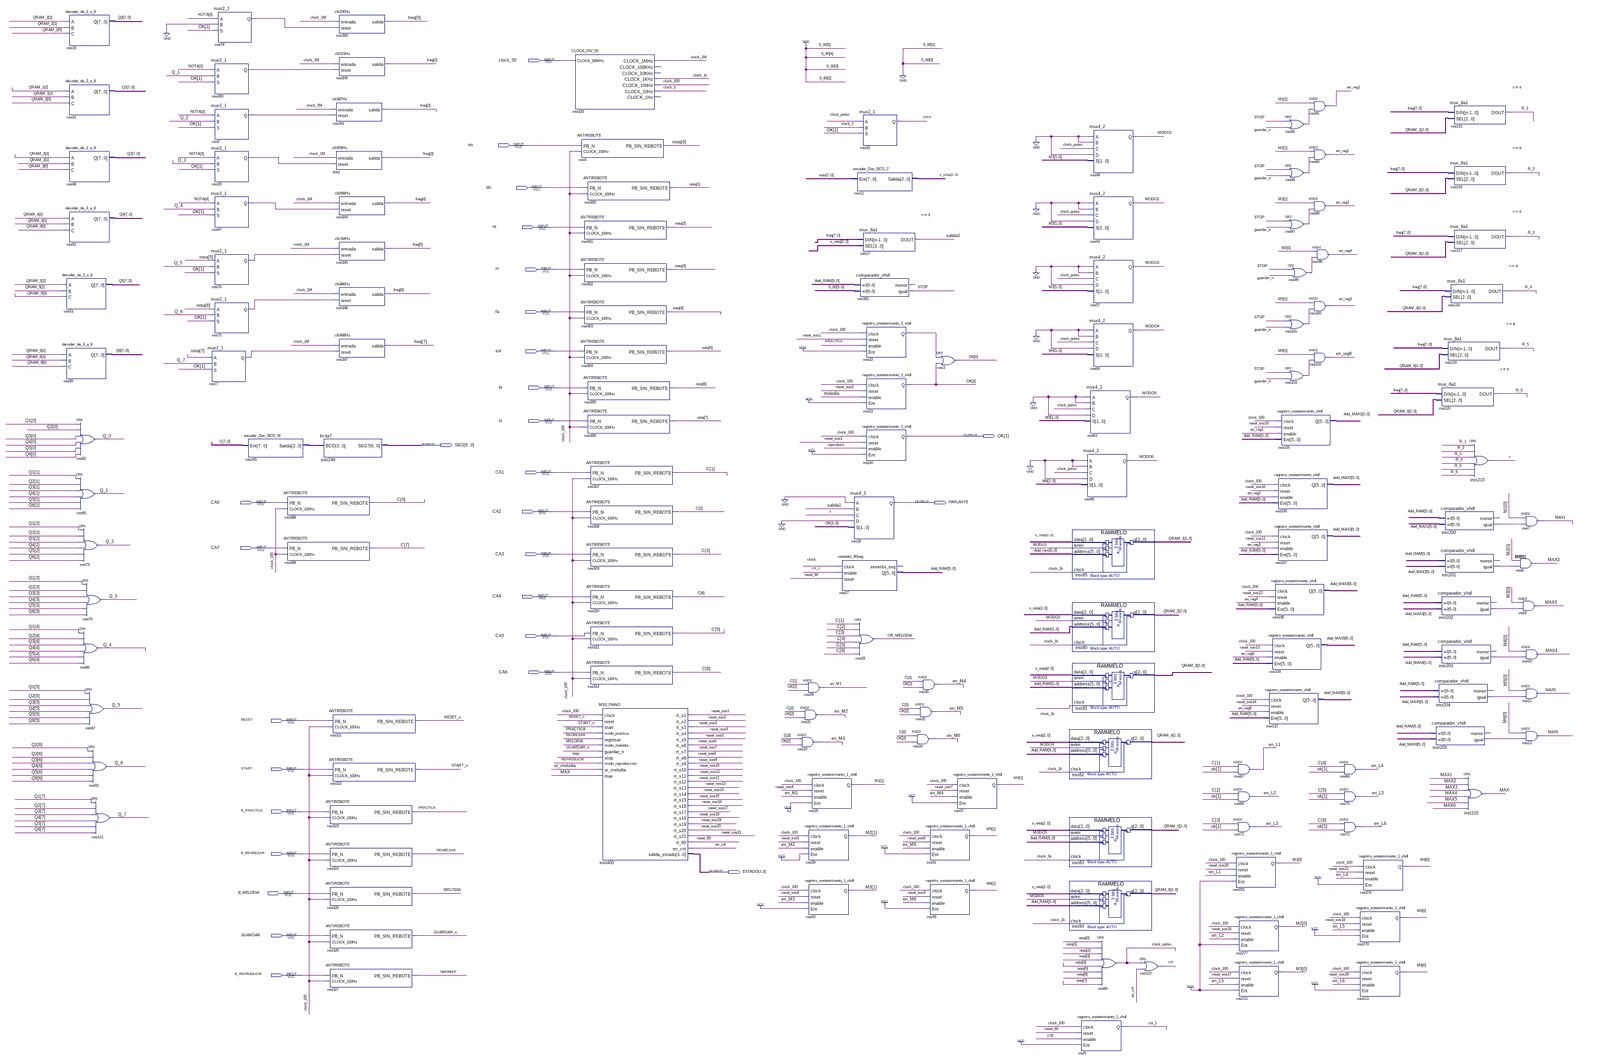
[diagram p0: schematic sheet, whole]
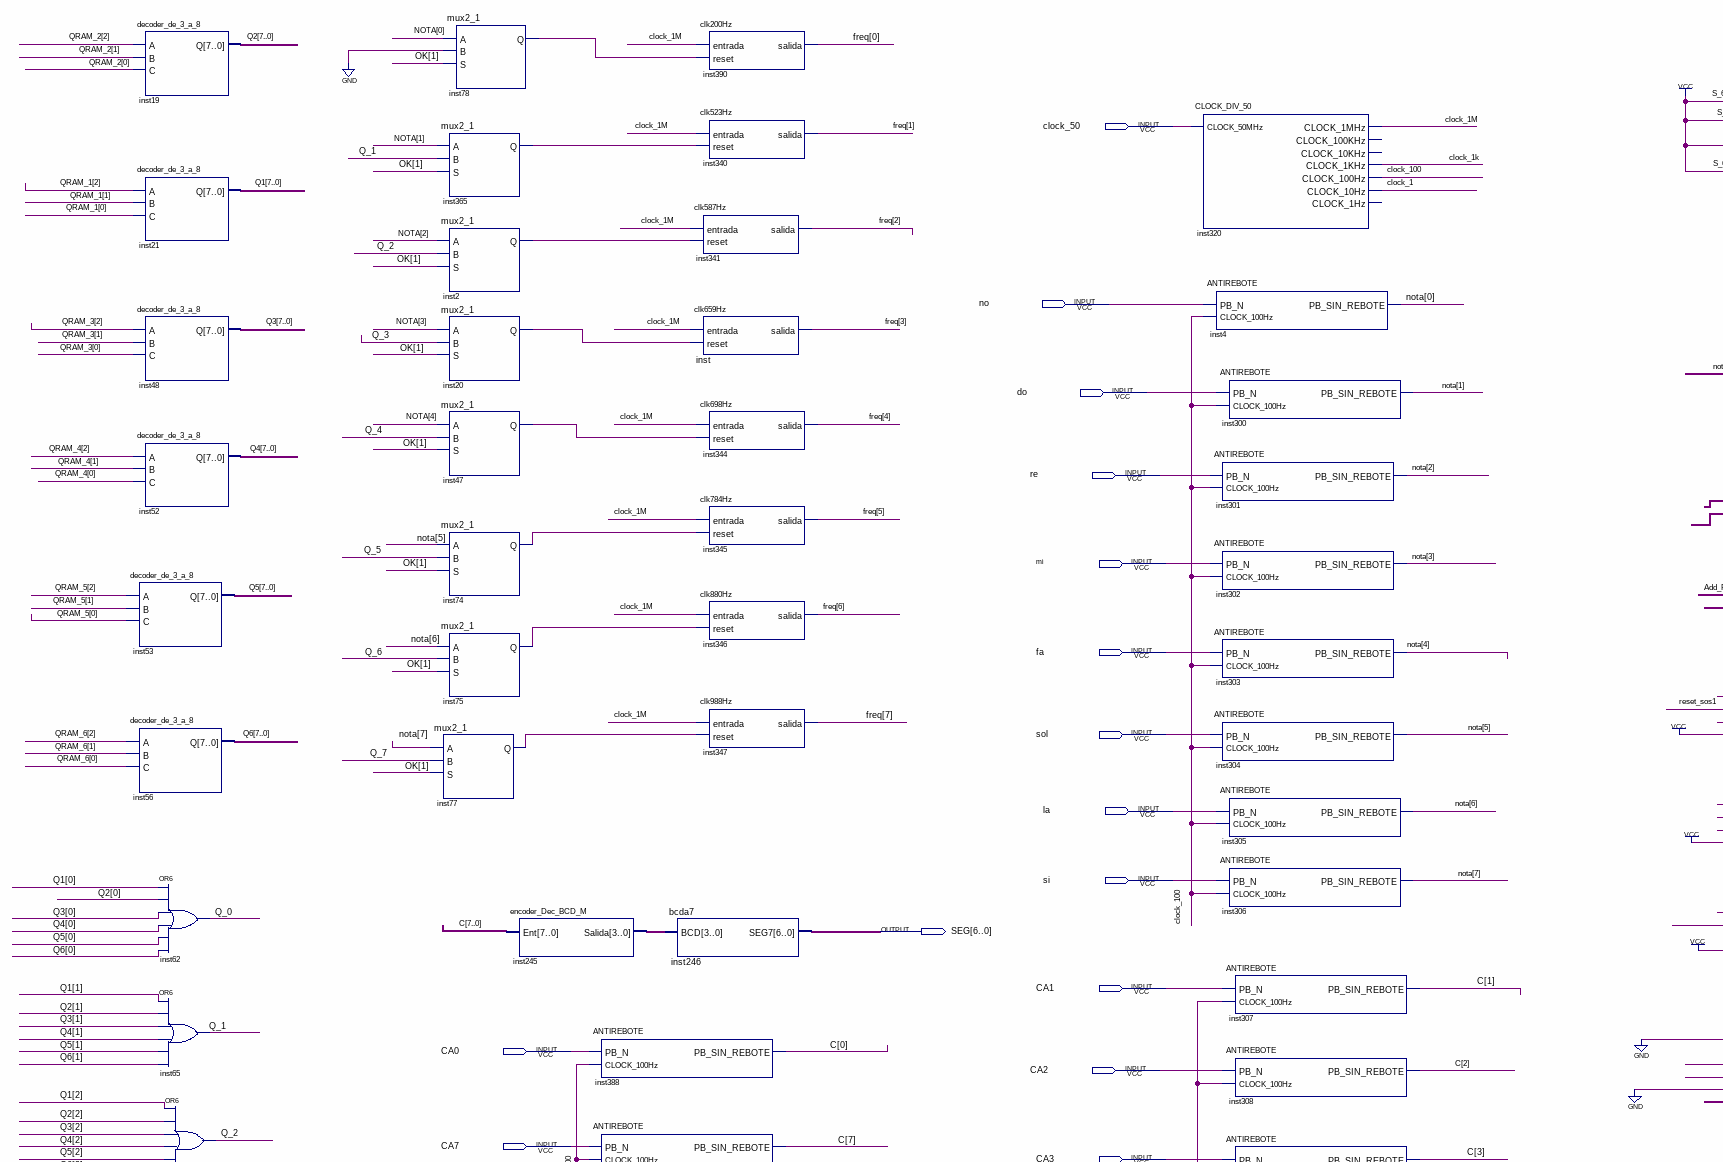
[diagram p1: schematic sheet, upper left part]
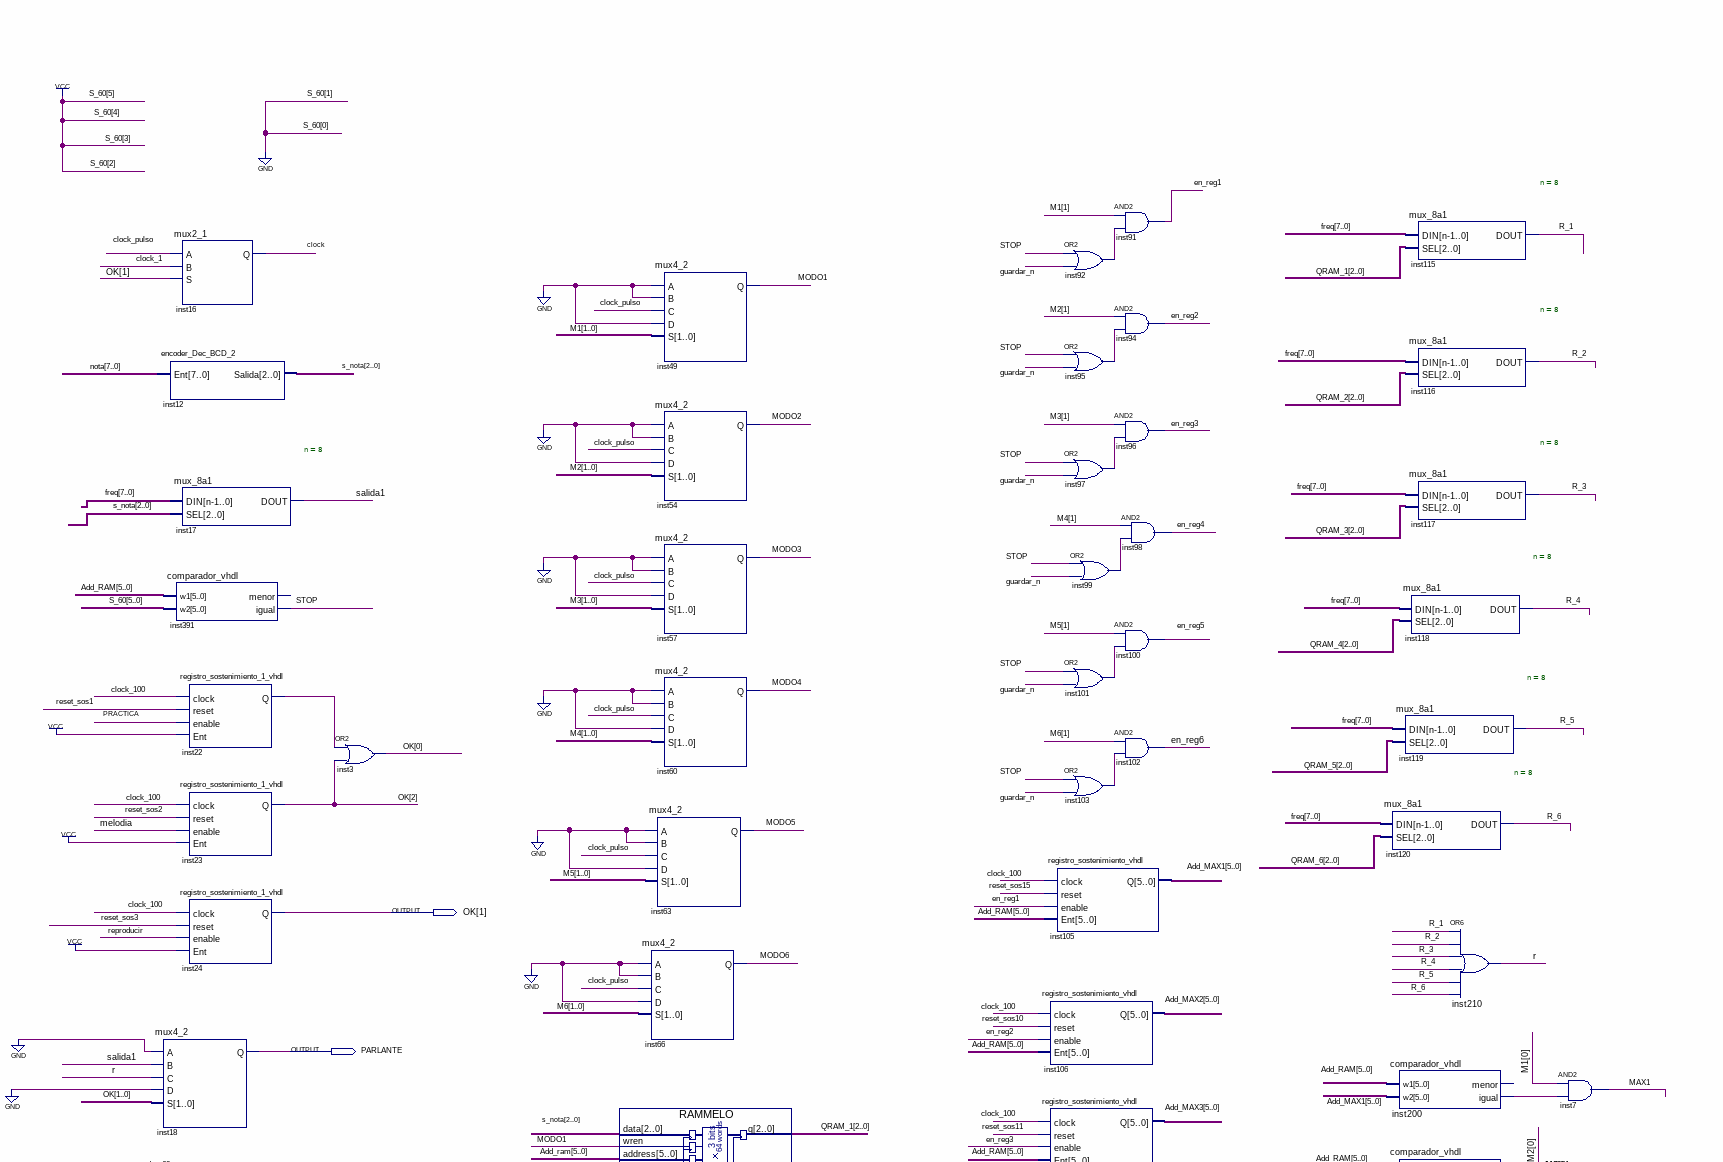
[diagram p2: schematic sheet, upper right part]
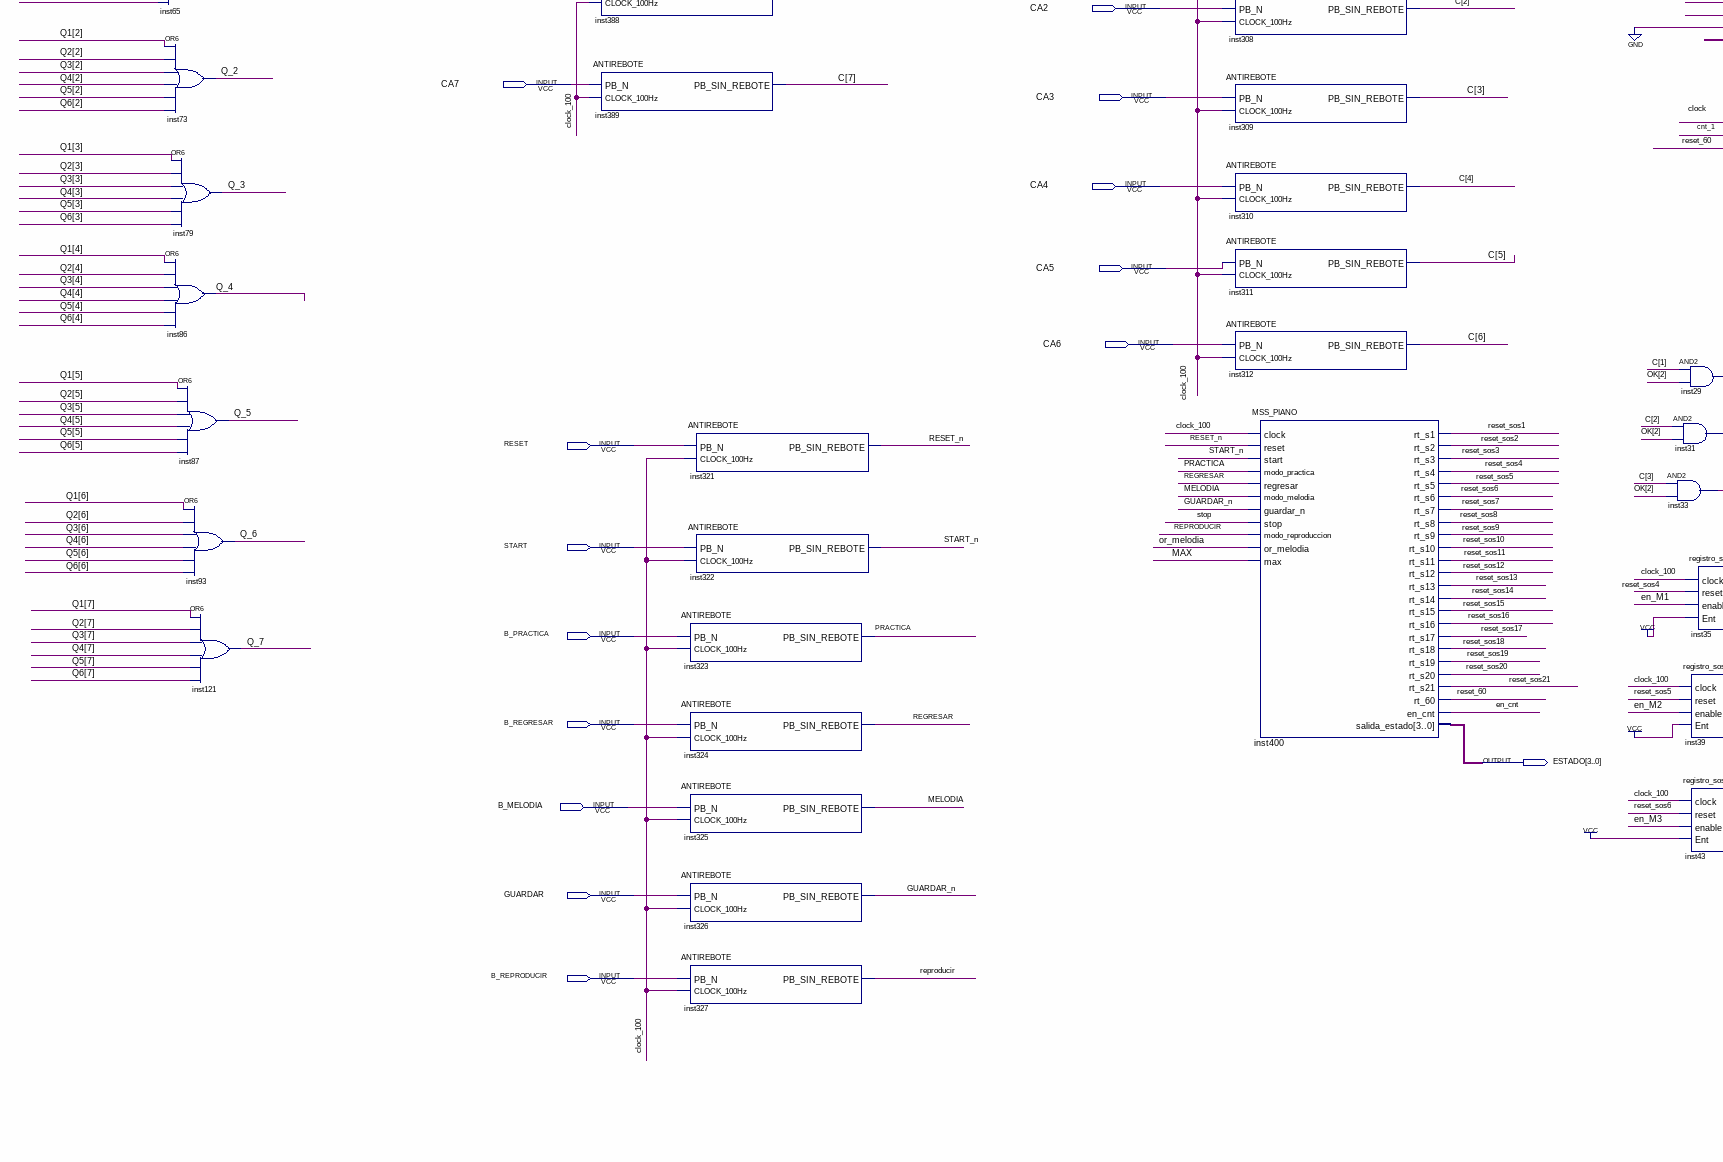
[diagram p3: schematic sheet, lower left part]
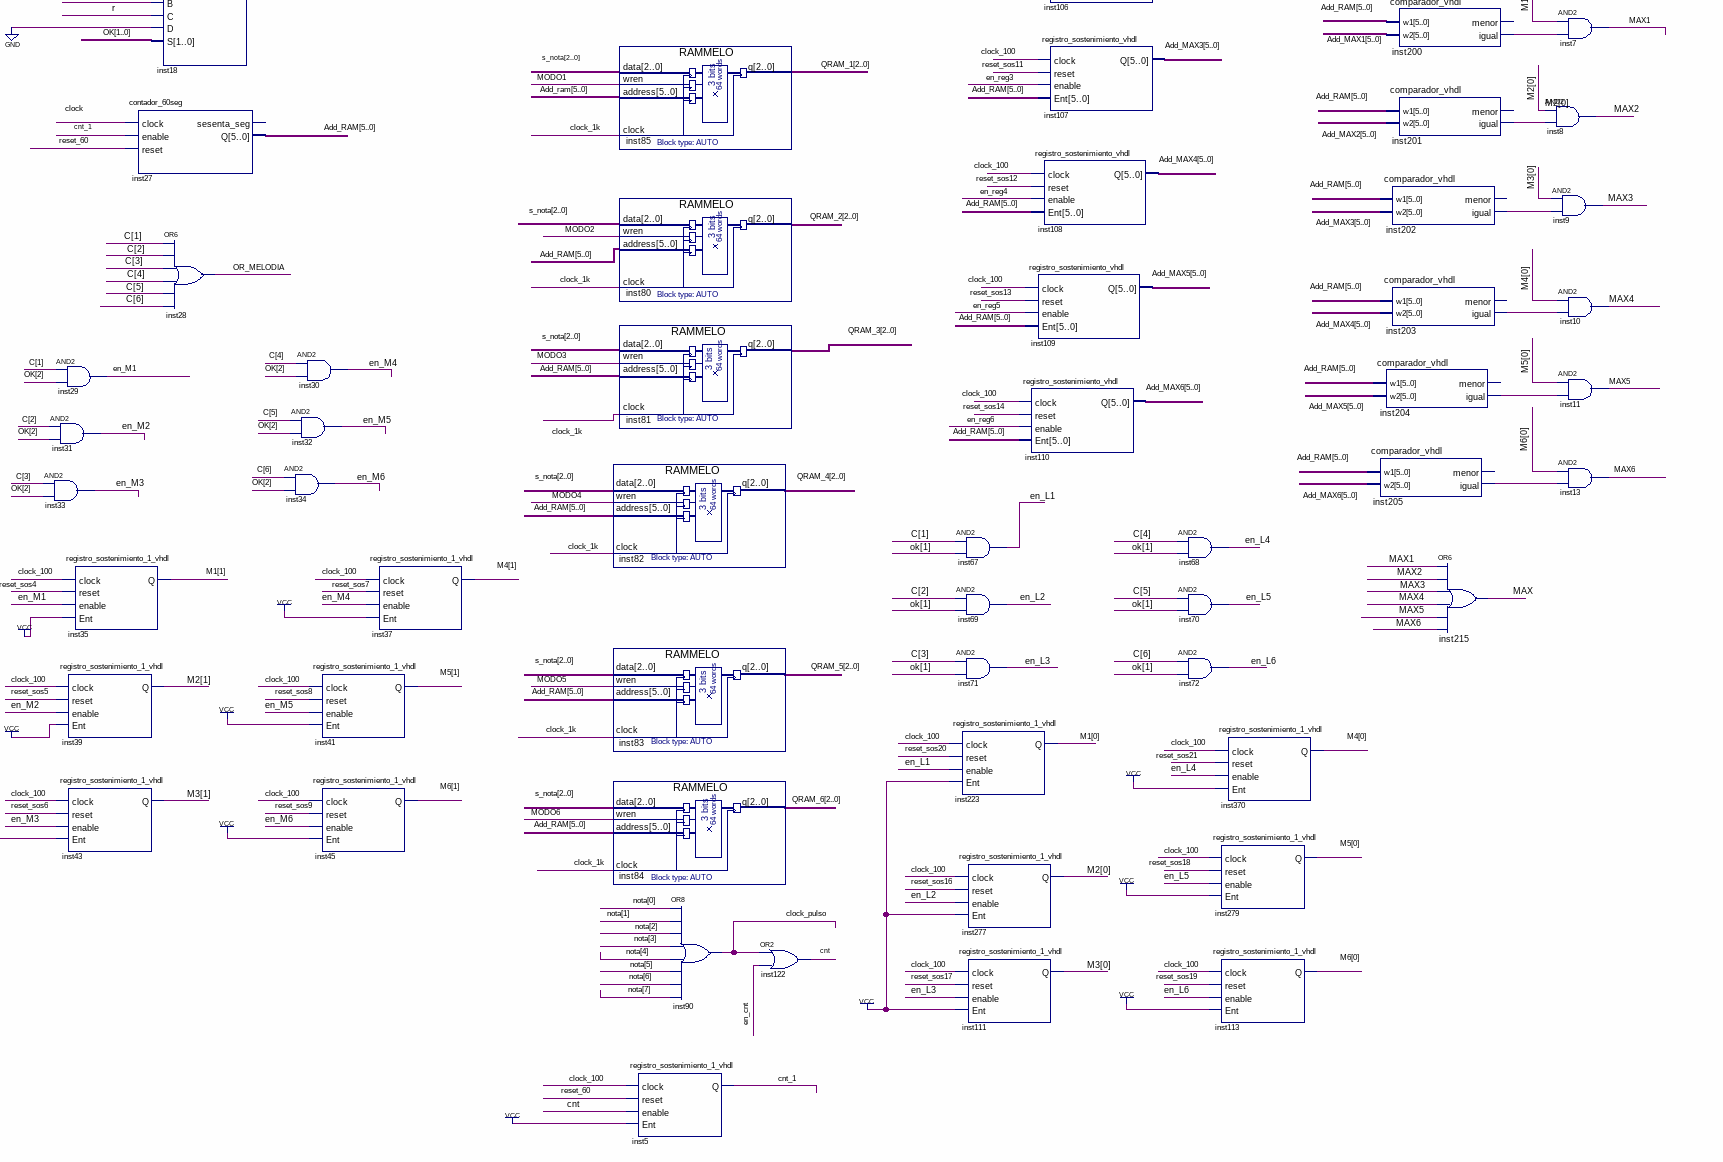
[diagram p4: schematic sheet, lower right part]
// Quartus schematic PIANO_PROTO.bdf as structural Verilog: 145 symbols, 28 pins
module PIANO_PROTO (
  input  clock_50,
  input  no,
  input  \do ,
  input  re,
  input  mi,
  input  fa,
  input  sol,
  input  la,
  input  si,
  input  CA1,
  input  CA0,
  input  CA2,
  input  CA7,
  input  CA3,
  input  CA4,
  input  CA5,
  input  CA6,
  input  RESET,
  input  START,
  input  B_PRACTICA,
  input  B_REGRESAR,
  input  B_MELODIA,
  input  GUARDAR,
  input  B_REPRODUCIR,
  output [2:0] OK,
  output [6:0] SEG,
  output PARLANTE,
  output [3:0] ESTADO
);

  wire clock, clock_1, clock_1k, clock_1M, clock_100, clock_pulso, cnt, cnt_1, en_cnt, en_L1, en_L2, en_L3,
       en_L4, en_L5, en_L6, en_M1, en_M2, en_M3, en_M4, en_M5, en_M6, en_reg1, en_reg2, en_reg3, en_reg4,
       en_reg5, en_reg6, guardar_n, inst2_q, inst20_q, inst22_q, inst47_q, inst74_q, inst75_q, inst77_q,
       inst78_q, inst92_out, inst95_out, inst97_out, inst99_out, inst101_out, inst103_out, inst200_igual,
       inst201_igual, inst202_igual, inst203_igual, inst204_igual, inst205_igual, inst365_q, MAX, MAX1, MAX2,
       MAX3, MAX4, MAX5, MAX6, melodia, MODO1, MODO2, MODO3, MODO4, MODO5, MODO6, or_melodia, PRACTICA, Q_0,
       Q_1, Q_2, Q_3, Q_4, Q_5, Q_6, Q_7, r, R_1, R_2, R_3, R_4, R_5, R_6, REGRESAR, reproducir, reset_60,
       RESET_n, reset_sos1, reset_sos2, reset_sos3, reset_sos4, reset_sos5, reset_sos6, reset_sos7,
       reset_sos8, reset_sos9, reset_sos10, reset_sos11, reset_sos12, reset_sos13, reset_sos14, reset_sos15,
       reset_sos16, reset_sos17, reset_sos18, reset_sos19, reset_sos20, reset_sos21, salida1, START_n, STOP;
  wire [1:0] M1, M2, M3, M4, M5, M6;
  wire [2:0] QRAM_1, QRAM_2, QRAM_3, QRAM_4, QRAM_5, QRAM_6, s_nota;
  wire [3:0] inst245_salida;
  wire [5:0] Add_MAX1, Add_MAX2, Add_MAX3, Add_MAX4, Add_MAX5, Add_MAX6, Add_RAM;
  wire [7:0] C, freq, nota, Q1, Q2, Q3, Q4, Q5, Q6;

  decoder_de_3_a_8 inst19 (.A(QRAM_2[2]), .B(QRAM_2[1]), .C(QRAM_2[0]), .Q(Q2));
  decoder_de_3_a_8 inst21 (.A(QRAM_1[2]), .B(QRAM_1[1]), .C(QRAM_1[0]), .Q(Q1));
  decoder_de_3_a_8 inst48 (.A(QRAM_3[2]), .B(QRAM_3[1]), .C(QRAM_3[0]), .Q(Q3));
  decoder_de_3_a_8 inst52 (.A(QRAM_4[2]), .B(QRAM_4[1]), .C(QRAM_4[0]), .Q(Q4));
  decoder_de_3_a_8 inst53 (.A(QRAM_5[2]), .B(QRAM_5[1]), .C(QRAM_5[0]), .Q(Q5));
  decoder_de_3_a_8 inst56 (.A(QRAM_6[2]), .B(QRAM_6[1]), .C(QRAM_6[0]), .Q(Q6));
  or inst62 (Q_0, Q1[0], Q2[0], Q3[0], Q4[0], Q5[0], Q6[0]);
  or inst65 (Q_1, Q1[1], Q2[1], Q3[1], Q4[1], Q5[1], Q6[1]);
  or inst73 (Q_2, Q1[2], Q2[2], Q3[2], Q4[2], Q5[2], Q6[2]);
  or inst79 (Q_3, Q1[3], Q2[3], Q3[3], Q4[3], Q5[3], Q6[3]);
  or inst86 (Q_4, Q1[4], Q2[4], Q3[4], Q4[4], Q5[4], Q6[4]);
  or inst87 (Q_5, Q1[5], Q2[5], Q3[5], Q4[5], Q5[5], Q6[5]);
  or inst93 (Q_6, Q1[6], Q2[6], Q3[6], Q4[6], Q5[6], Q6[6]);
  or inst121 (Q_7, Q1[7], Q2[7], Q3[7], Q4[7], Q5[7], Q6[7]);
  mux2_1 inst78 (.A(nota[0]), .B(1'b0), .S(OK[1]), .Q(inst78_q));
  mux2_1 inst365 (.A(nota[1]), .B(Q_1), .S(OK[1]), .Q(inst365_q));
  mux2_1 inst2 (.A(nota[2]), .B(Q_2), .S(OK[1]), .Q(inst2_q));
  mux2_1 inst20 (.A(nota[3]), .B(Q_3), .S(OK[1]), .Q(inst20_q));
  mux2_1 inst47 (.A(nota[4]), .B(Q_4), .S(OK[1]), .Q(inst47_q));
  mux2_1 inst74 (.A(nota[5]), .B(Q_5), .S(OK[1]), .Q(inst74_q));
  mux2_1 inst75 (.A(nota[6]), .B(Q_6), .S(OK[1]), .Q(inst75_q));
  mux2_1 inst77 (.A(nota[7]), .B(Q_7), .S(OK[1]), .Q(inst77_q));
  encoder_Dec_BCD_M inst245 (.Ent(C), .Salida(inst245_salida));
  ANTIREBOTE inst388 (.PB_N(CA0), .CLOCK_100Hz(clock_100), .PB_SIN_REBOTE(C[0]));
  ANTIREBOTE inst389 (.PB_N(CA7), .CLOCK_100Hz(clock_100), .PB_SIN_REBOTE(C[7]));
  clk200Hz inst390 (.entrada(clock_1M), .reset(inst78_q), .salida(freq[0]));
  clk523Hz inst340 (.entrada(clock_1M), .reset(inst365_q), .salida(freq[1]));
  clk587Hz inst341 (.entrada(clock_1M), .reset(inst2_q), .salida(freq[2]));
  clk659Hz inst (.entrada(clock_1M), .reset(inst20_q), .salida(freq[3]));
  clk698Hz inst344 (.entrada(clock_1M), .reset(inst47_q), .salida(freq[4]));
  clk784Hz inst345 (.entrada(clock_1M), .reset(inst74_q), .salida(freq[5]));
  clk880Hz inst346 (.entrada(clock_1M), .reset(inst75_q), .salida(freq[6]));
  clk988Hz inst347 (.entrada(clock_1M), .reset(inst77_q), .salida(freq[7]));
  bcda7 inst246 (.BCD(inst245_salida), .SEG7(SEG));
  ANTIREBOTE inst321 (.PB_N(RESET), .CLOCK_100Hz(clock_100), .PB_SIN_REBOTE(RESET_n));
  ANTIREBOTE inst322 (.PB_N(START), .CLOCK_100Hz(clock_100), .PB_SIN_REBOTE(START_n));
  ANTIREBOTE inst323 (.PB_N(B_PRACTICA), .CLOCK_100Hz(clock_100), .PB_SIN_REBOTE(PRACTICA));
  ANTIREBOTE inst324 (.PB_N(B_REGRESAR), .CLOCK_100Hz(clock_100), .PB_SIN_REBOTE(REGRESAR));
  ANTIREBOTE inst325 (.PB_N(B_MELODIA), .CLOCK_100Hz(clock_100), .PB_SIN_REBOTE(melodia));
  ANTIREBOTE inst326 (.PB_N(GUARDAR), .CLOCK_100Hz(clock_100), .PB_SIN_REBOTE(guardar_n));
  ANTIREBOTE inst327 (.PB_N(B_REPRODUCIR), .CLOCK_100Hz(clock_100), .PB_SIN_REBOTE(reproducir));
  CLOCK_DIV_50 inst320 (
    .CLOCK_50MHz(clock_50), .CLOCK_1MHz(clock_1M), .CLOCK_1KHz(clock_1k), .CLOCK_100Hz(clock_100),
    .CLOCK_10Hz(clock_1));  // open: CLOCK_100KHz, CLOCK_10KHz, CLOCK_1Hz
  ANTIREBOTE inst4 (.PB_N(no), .CLOCK_100Hz(clock_100), .PB_SIN_REBOTE(nota[0]));
  ANTIREBOTE inst301 (.PB_N(re), .CLOCK_100Hz(clock_100), .PB_SIN_REBOTE(nota[2]));
  ANTIREBOTE inst302 (.PB_N(mi), .CLOCK_100Hz(clock_100), .PB_SIN_REBOTE(nota[3]));
  ANTIREBOTE inst303 (.PB_N(fa), .CLOCK_100Hz(clock_100), .PB_SIN_REBOTE(nota[4]));
  ANTIREBOTE inst304 (.PB_N(sol), .CLOCK_100Hz(clock_100), .PB_SIN_REBOTE(nota[5]));
  ANTIREBOTE inst300 (.PB_N(\do ), .CLOCK_100Hz(clock_100), .PB_SIN_REBOTE(nota[1]));
  ANTIREBOTE inst305 (.PB_N(la), .CLOCK_100Hz(clock_100), .PB_SIN_REBOTE(nota[6]));
  ANTIREBOTE inst306 (.PB_N(si), .CLOCK_100Hz(clock_100), .PB_SIN_REBOTE(nota[7]));
  ANTIREBOTE inst307 (.PB_N(CA1), .CLOCK_100Hz(clock_100), .PB_SIN_REBOTE(C[1]));
  ANTIREBOTE inst308 (.PB_N(CA2), .CLOCK_100Hz(clock_100), .PB_SIN_REBOTE(C[2]));
  ANTIREBOTE inst309 (.PB_N(CA3), .CLOCK_100Hz(clock_100), .PB_SIN_REBOTE(C[3]));
  ANTIREBOTE inst310 (.PB_N(CA4), .CLOCK_100Hz(clock_100), .PB_SIN_REBOTE(C[4]));
  ANTIREBOTE inst311 (.PB_N(CA5), .CLOCK_100Hz(clock_100), .PB_SIN_REBOTE(C[5]));
  ANTIREBOTE inst312 (.PB_N(CA6), .CLOCK_100Hz(clock_100), .PB_SIN_REBOTE(C[6]));
  MSS_PIANO inst400 (
    .clock(clock_100), .reset(RESET_n), .start(START_n), .modo_practica(PRACTICA), .regresar(REGRESAR),
    .modo_melodia(melodia), .guardar_n(guardar_n), .stop(STOP), .modo_reproduccion(reproducir),
    .or_melodia(or_melodia), .max(MAX), .rt_s1(reset_sos1), .rt_s2(reset_sos2), .rt_s3(reset_sos3),
    .rt_s4(reset_sos4), .rt_s5(reset_sos5), .rt_s6(reset_sos6), .rt_s7(reset_sos7), .rt_s8(reset_sos8),
    .rt_s9(reset_sos9), .rt_s10(reset_sos10), .rt_s11(reset_sos11), .rt_s12(reset_sos12),
    .rt_s13(reset_sos13), .rt_s14(reset_sos14), .rt_s15(reset_sos15), .rt_s16(reset_sos16),
    .rt_s17(reset_sos17), .rt_s18(reset_sos18), .rt_s19(reset_sos19), .rt_s20(reset_sos20),
    .rt_s21(reset_sos21), .rt_60(reset_60), .en_cnt(en_cnt), .salida_estado(ESTADO));
  and inst33 (en_M3, C[3], OK[2]);
  and inst29 (en_M1, C[1], OK[2]);
  and inst31 (en_M2, C[2], OK[2]);
  registro_sostenimiento_1_vhdl inst35 (.clock(clock_100), .reset(reset_sos4), .enable(en_M1), .Ent(1'b1), .Q(M1[1]));
  registro_sostenimiento_1_vhdl inst39 (.clock(clock_100), .reset(reset_sos5), .enable(en_M2), .Ent(1'b1), .Q(M2[1]));
  registro_sostenimiento_1_vhdl inst43 (.clock(clock_100), .reset(reset_sos6), .enable(en_M3), .Ent(1'b1), .Q(M3[1]));
  contador_60seg inst27 (.clock(clock), .enable(cnt_1), .reset(reset_60), .Q(Add_RAM));  // open: sesenta_seg
  mux2_1 inst16 (.A(clock_pulso), .B(clock_1), .S(OK[1]), .Q(clock));
  encoder_Dec_BCD_2 inst12 (.Ent(nota), .Salida(s_nota));
  mux_8a1 #(.n(8)) inst17 (.DIN(freq), .SEL(s_nota), .DOUT(salida1));
  comparador_vhdl inst391 (.w1(Add_RAM), .w2(6'b111100), .igual(STOP));  // open: menor
  registro_sostenimiento_1_vhdl inst22 (
    .clock(clock_100), .reset(reset_sos1), .enable(PRACTICA), .Ent(1'b1), .Q(inst22_q));
  registro_sostenimiento_1_vhdl inst23 (.clock(clock_100), .reset(reset_sos2), .enable(melodia), .Ent(1'b1), .Q(OK[2]));
  registro_sostenimiento_1_vhdl inst24 (
    .clock(clock_100), .reset(reset_sos3), .enable(reproducir), .Ent(1'b1), .Q(OK[1]));
  mux4_2 inst18 (.A(1'b0), .B(salida1), .C(r), .D(1'b0), .S(OK[1:0]), .Q(PARLANTE));
  or inst28 (or_melodia, C[1], C[2], C[3], C[4], C[5], C[6]);
  and inst30 (en_M4, C[4], OK[2]);
  and inst32 (en_M5, C[5], OK[2]);
  and inst34 (en_M6, C[6], OK[2]);
  or inst3 (OK[0], inst22_q, OK[2]);
  registro_sostenimiento_1_vhdl inst41 (.clock(clock_100), .reset(reset_sos8), .enable(en_M5), .Ent(1'b1), .Q(M5[1]));
  registro_sostenimiento_1_vhdl inst45 (.clock(clock_100), .reset(reset_sos9), .enable(en_M6), .Ent(1'b1), .Q(M6[1]));
  registro_sostenimiento_1_vhdl inst37 (.clock(clock_100), .reset(reset_sos7), .enable(en_M4), .Ent(1'b1), .Q(M4[1]));
  mux4_2 inst49 (.A(1'b0), .B(1'b0), .C(clock_pulso), .D(1'b0), .S(M1), .Q(MODO1));
  mux4_2 inst54 (.A(1'b0), .B(1'b0), .C(clock_pulso), .D(1'b0), .S(M2), .Q(MODO2));
  mux4_2 inst57 (.A(1'b0), .B(1'b0), .C(clock_pulso), .D(1'b0), .S(M3), .Q(MODO3));
  mux4_2 inst60 (.A(1'b0), .B(1'b0), .C(clock_pulso), .D(1'b0), .S(M4), .Q(MODO4));
  mux4_2 inst63 (.A(1'b0), .B(1'b0), .C(clock_pulso), .D(1'b0), .S(M5), .Q(MODO5));
  mux4_2 inst66 (.A(1'b0), .B(1'b0), .C(clock_pulso), .D(1'b0), .S(M6), .Q(MODO6));
  RAMMELO inst85 (.data(s_nota), .wren(MODO1), .address(Add_RAM), .clock(clock_1k), .q(QRAM_1));
  RAMMELO inst80 (.data(s_nota), .wren(MODO2), .address(Add_RAM), .clock(clock_1k), .q(QRAM_2));
  RAMMELO inst81 (.data(s_nota), .wren(MODO3), .address(Add_RAM), .clock(clock_1k), .q(QRAM_3));
  RAMMELO inst82 (.data(s_nota), .wren(MODO4), .address(Add_RAM), .clock(clock_1k), .q(QRAM_4));
  RAMMELO inst83 (.data(s_nota), .wren(MODO5), .address(Add_RAM), .clock(clock_1k), .q(QRAM_5));
  RAMMELO inst84 (.data(s_nota), .wren(MODO6), .address(Add_RAM), .clock(clock_1k), .q(QRAM_6));
  registro_sostenimiento_1_vhdl inst5 (.clock(clock_100), .reset(reset_60), .enable(cnt), .Ent(1'b1), .Q(cnt_1));
  or inst90 (clock_pulso, nota[0], nota[1], nota[2], nota[3], nota[4], nota[5], nota[6], nota[7]);
  or inst122 (cnt, clock_pulso, en_cnt);
  and inst67 (en_L1, C[1], OK[1]);
  and inst69 (en_L2, C[2], OK[1]);
  and inst71 (en_L3, C[3], OK[1]);
  registro_sostenimiento_1_vhdl inst223 (.clock(clock_100), .reset(reset_sos20), .enable(en_L1), .Ent(1'b1), .Q(M1[0]));
  registro_sostenimiento_1_vhdl inst277 (.clock(clock_100), .reset(reset_sos16), .enable(en_L2), .Ent(1'b1), .Q(M2[0]));
  registro_sostenimiento_1_vhdl inst111 (.clock(clock_100), .reset(reset_sos17), .enable(en_L3), .Ent(1'b1), .Q(M3[0]));
  registro_sostenimiento_vhdl inst105 (
    .clock(clock_100), .reset(reset_sos15), .enable(en_reg1), .Ent(Add_RAM), .Q(Add_MAX1));
  registro_sostenimiento_vhdl inst106 (
    .clock(clock_100), .reset(reset_sos10), .enable(en_reg2), .Ent(Add_RAM), .Q(Add_MAX2));
  registro_sostenimiento_vhdl inst107 (
    .clock(clock_100), .reset(reset_sos11), .enable(en_reg3), .Ent(Add_RAM), .Q(Add_MAX3));
  registro_sostenimiento_vhdl inst108 (
    .clock(clock_100), .reset(reset_sos12), .enable(en_reg4), .Ent(Add_RAM), .Q(Add_MAX4));
  registro_sostenimiento_vhdl inst109 (
    .clock(clock_100), .reset(reset_sos13), .enable(en_reg5), .Ent(Add_RAM), .Q(Add_MAX5));
  registro_sostenimiento_vhdl inst110 (
    .clock(clock_100), .reset(reset_sos14), .enable(en_reg6), .Ent(Add_RAM), .Q(Add_MAX6));
  or inst92 (inst92_out, STOP, guardar_n);
  or inst95 (inst95_out, STOP, guardar_n);
  or inst97 (inst97_out, STOP, guardar_n);
  or inst99 (inst99_out, STOP, guardar_n);
  or inst101 (inst101_out, STOP, guardar_n);
  or inst103 (inst103_out, STOP, guardar_n);
  and inst91 (en_reg1, M1[1], inst92_out);
  and inst94 (en_reg2, M2[1], inst95_out);
  and inst96 (en_reg3, M3[1], inst97_out);
  and inst98 (en_reg4, M4[1], inst99_out);
  and inst100 (en_reg5, M5[1], inst101_out);
  and inst102 (en_reg6, M6[1], inst103_out);
  and inst68 (en_L4, C[4], OK[1]);
  and inst70 (en_L5, C[5], OK[1]);
  and inst72 (en_L6, C[6], OK[1]);
  registro_sostenimiento_1_vhdl inst279 (.clock(clock_100), .reset(reset_sos18), .enable(en_L5), .Ent(1'b1), .Q(M5[0]));
  registro_sostenimiento_1_vhdl inst113 (.clock(clock_100), .reset(reset_sos19), .enable(en_L6), .Ent(1'b1), .Q(M6[0]));
  registro_sostenimiento_1_vhdl inst370 (.clock(clock_100), .reset(reset_sos21), .enable(en_L4), .Ent(1'b1), .Q(M4[0]));
  mux_8a1 #(.n(8)) inst115 (.DIN(freq), .SEL(QRAM_1), .DOUT(R_1));
  mux_8a1 #(.n(8)) inst116 (.DIN(freq), .SEL(QRAM_2), .DOUT(R_2));
  mux_8a1 #(.n(8)) inst117 (.DIN(freq), .SEL(QRAM_3), .DOUT(R_3));
  mux_8a1 #(.n(8)) inst118 (.DIN(freq), .SEL(QRAM_4), .DOUT(R_4));
  mux_8a1 #(.n(8)) inst119 (.DIN(freq), .SEL(QRAM_5), .DOUT(R_5));
  mux_8a1 #(.n(8)) inst120 (.DIN(freq), .SEL(QRAM_6), .DOUT(R_6));
  comparador_vhdl inst200 (.w1(Add_RAM), .w2(Add_MAX1), .igual(inst200_igual));  // open: menor
  comparador_vhdl inst201 (.w1(Add_RAM), .w2(Add_MAX2), .igual(inst201_igual));  // open: menor
  comparador_vhdl inst202 (.w1(Add_RAM), .w2(Add_MAX3), .igual(inst202_igual));  // open: menor
  comparador_vhdl inst203 (.w1(Add_RAM), .w2(Add_MAX4), .igual(inst203_igual));  // open: menor
  comparador_vhdl inst204 (.w1(Add_RAM), .w2(Add_MAX5), .igual(inst204_igual));  // open: menor
  comparador_vhdl inst205 (.w1(Add_RAM), .w2(Add_MAX6), .igual(inst205_igual));  // open: menor
  or inst210 (r, R_1, R_2, R_3, R_4, R_5, R_6);
  or inst215 (MAX, MAX1, MAX2, MAX3, MAX4, MAX5, MAX6);
  and inst7 (MAX1, M1[0], inst200_igual);
  and inst8 (MAX2, M2[0], inst201_igual);
  and inst9 (MAX3, M3[0], inst202_igual);
  and inst10 (MAX4, M4[0], inst203_igual);
  and inst11 (MAX5, M5[0], inst204_igual);
  and inst13 (MAX6, M6[0], inst205_igual);
endmodule
